# Altium schematic sheet 407.SchDoc
size A1
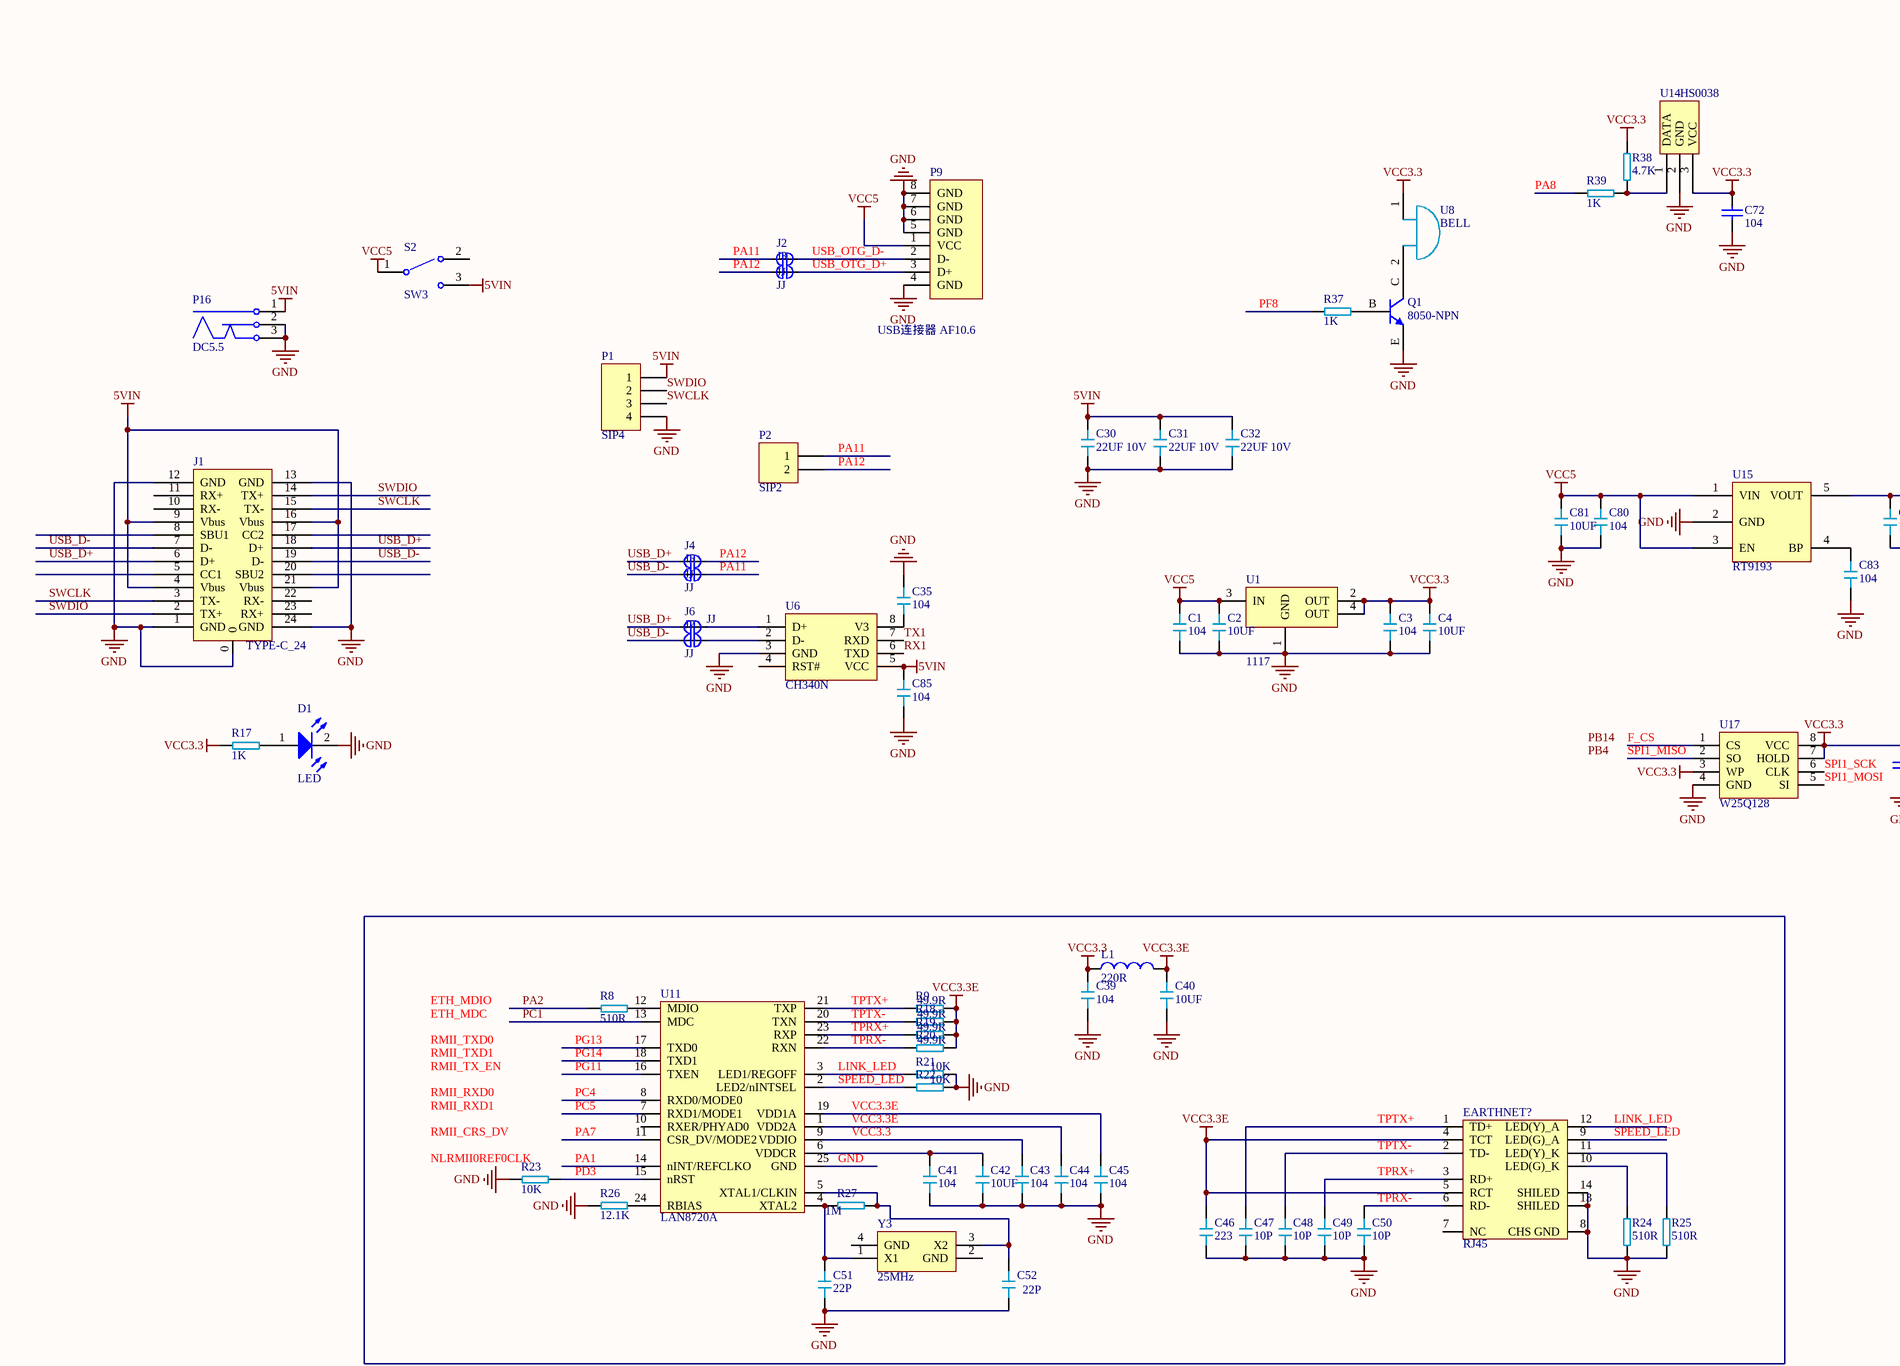
[diagram p0: 407.SchDoc, top left]
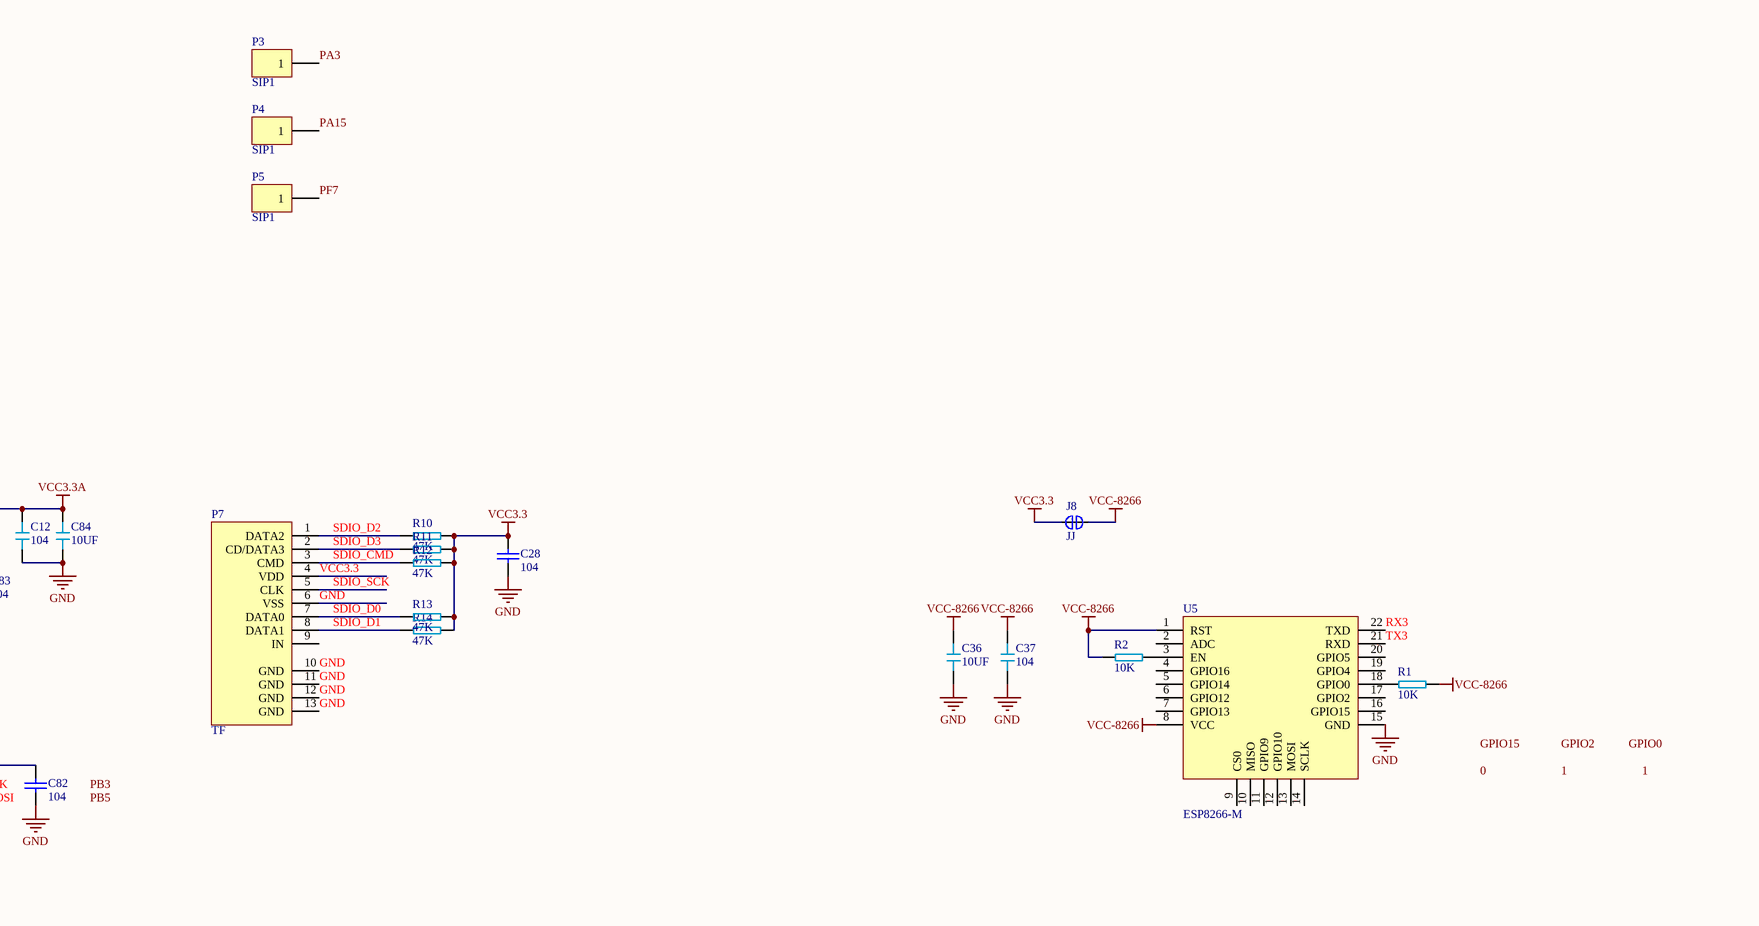
[diagram p1: 407.SchDoc, top right]
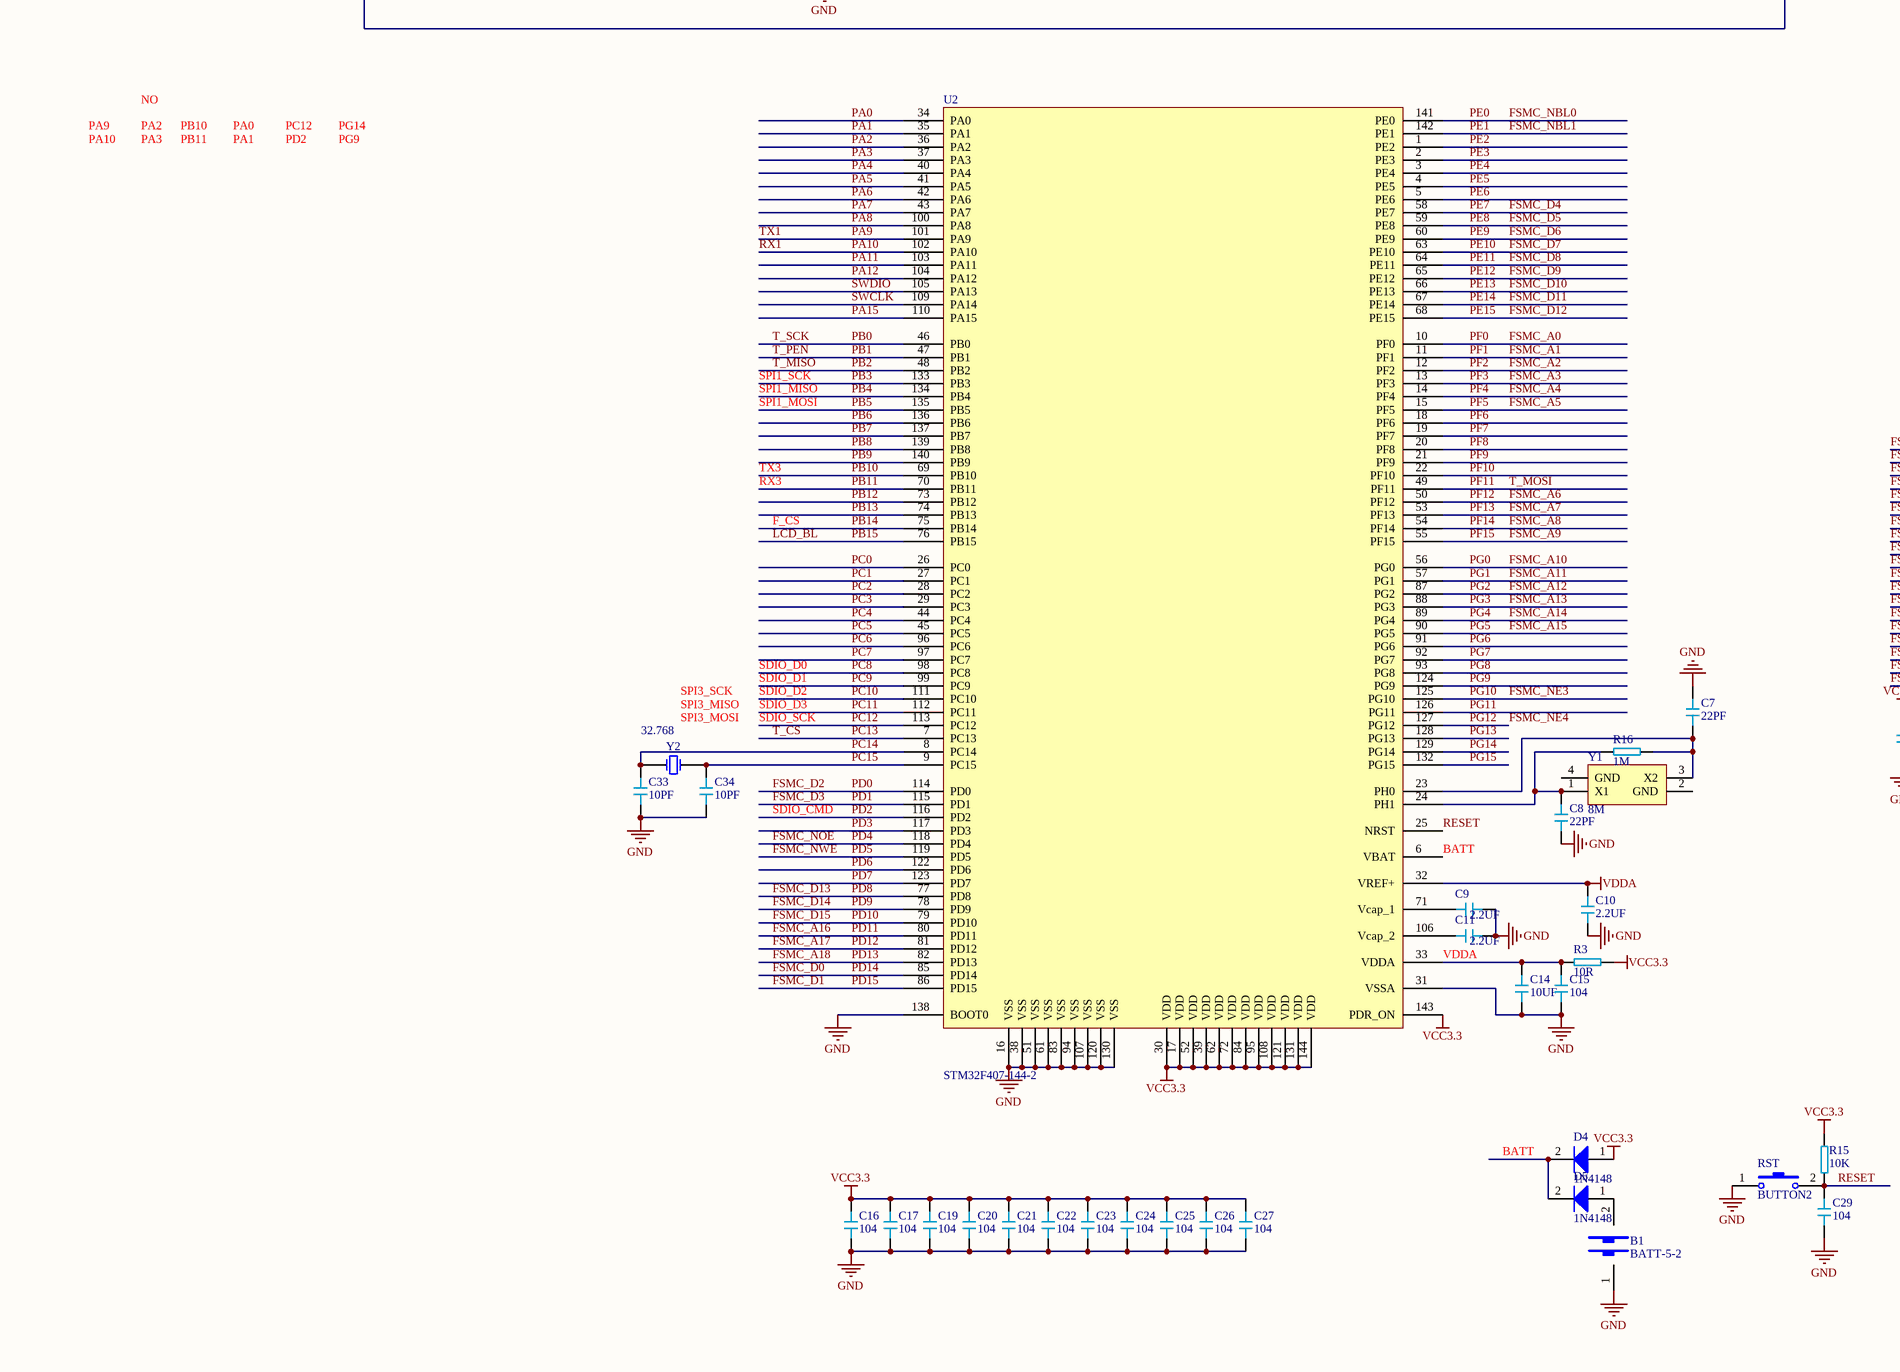
[diagram p2: 407.SchDoc, bottom left]
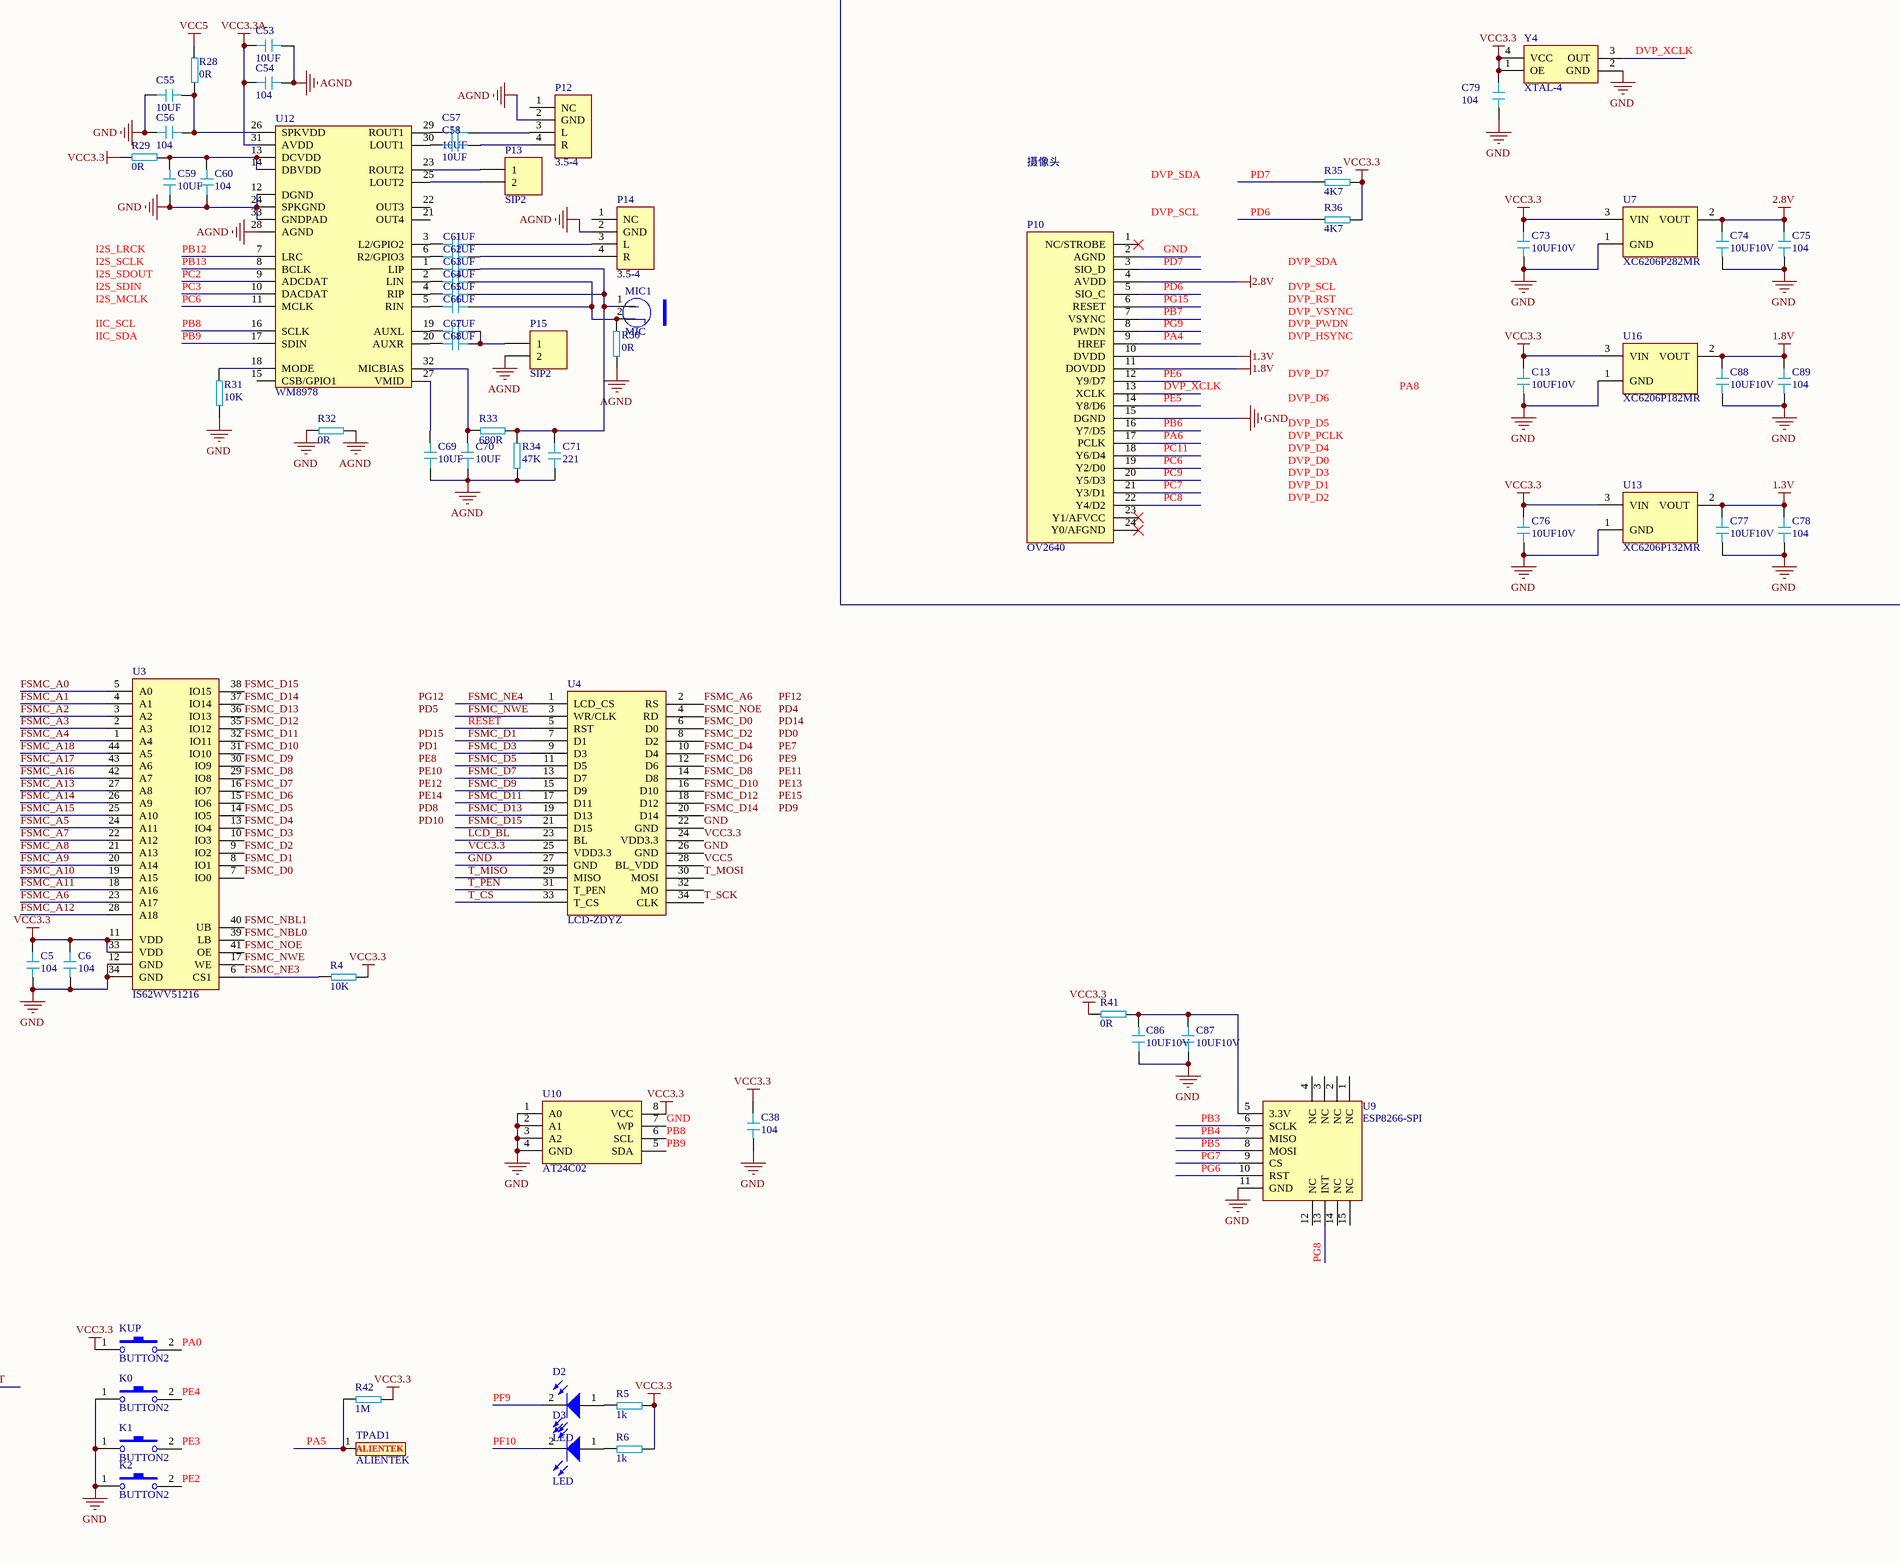
[diagram p3: 407.SchDoc, bottom right]

## Parts
B1  BATT-5-2  [BATT1210]
C1  104  [C0402]
C2  10UF  [C0603]
C3  104  [C0402]
C4  10UF  [C0603]
C5  104  [C0402]
C6  104  [C0402]
C7  22PF  [C0402]
C8  22PF  [C0402]
C9  2.2UF  [C0402]
C10  2.2UF  [C0402]
C11  2.2UF  [C0402]
C12  104  [C0402]
C13  10UF10V  [C0603]
C14  10UF  [C0402]
C15  104  [C0402]
C16  104  [C0402]
C17  104  [C0402]
C19  104  [C0402]
C20  104  [C0402]
C21  104  [C0402]
C22  104  [C0402]
C23  104  [C0402]
C24  104  [C0402]
C25  104  [C0402]
C26  104  [C0402]
C27  104  [C0402]
C28  104  [C0402]
C29  104  [C0402]
C30  22UF 10V  [C0805]
C31  22UF 10V  [C0805]
C32  22UF 10V  [C0805]
C33  10PF  [C0402]
C34  10PF  [C0402]
C35  104  [C0402]
C36  10UF  [C0603]
C37  104  [C0402]
C38  104  [C0402]
C39  104  [C0402]
C40  10UF  [C0603]
C41  104  [C0402]
C42  10UF  [C0603]
C43  104  [C0402]
C44  104  [C0402]
C45  104  [C0402]
C46  223  [C0402]
C47  10P  [C0402]
C48  10P  [C0402]
C49  10P  [C0402]
C50  10P  [C0402]
C51  22P  [C0402]
C52  22P  [C0402]
C53  10UF  [C0603]
C54  104  [C0402]
C55  10UF  [C0603]
C56  104  [C0402]
C57  10UF  [C0603]
C58  10UF  [C0603]
C59  10UF  [C0603]
C60  104  [C0402]
C61  1UF  [C0402]
C62  1UF  [C0402]
C63  1UF  [C0402]
C64  1UF  [C0402]
C65  1UF  [C0402]
C66  1UF  [C0402]
C67  1UF  [C0402]
C68  1UF  [C0402]
C69  10UF  [C0603]
C70  10UF  [C0603]
C71  221  [C0402]
C72  104  [C0402]
C73  10UF10V  [C0603]
C74  10UF10V  [C0603]
C75  104  [C0402]
C76  10UF10V  [C0603]
C77  10UF10V  [C0603]
C78  104  [C0402]
C79  104  [C0402]
C80  104  [C0402]
C81  10UF  [C0603]
C82  104  [C0402]
C83  104  [C0402]
C84  10UF  [C0603]
C85  104  [C0402]
C86  10UF10V  [C0603]
C87  10UF10V  [C0603]
C88  10UF10V  [C0603]
C89  104  [C0402]
D1  LED  [LED0603]
D2  LED  [LED0603]
D3  LED  [LED0603]
D4  1N4148  [SOD123]
D5  1N4148  [SOD123]
EARTHNET?  RJ45  [HR911105A]
J1  TYPE-C_24  [TYPE-C24P]
J2  JJ  [JJ]
J3  JJ  [JJ]
J4  JJ  [JJ]
J5  JJ  [JJ]
J6  JJ  [JJ]
J7  JJ  [JJ]
J8  JJ  [JJ]
K0  BUTTON2  [BUTTON-SMD-6*6-4]
K1  BUTTON2  [BUTTON-SMD-6*6-4]
K2  BUTTON2  [BUTTON-SMD-6*6-4]
KUP  BUTTON2  [BUTTON-SMD-6*6-4]
L1  220R  [R0603]
MIC1  MIC  [MIC-6022]
P1  SIP4  [SIP4-DIP-90]
P2  SIP2  [SIP2]
P3  SIP1  [TEST-SMD-1.5MM]
P4  SIP1  [TEST-SMD-1.5MM]
P5  SIP1  [TEST-SMD-1.5MM]
P7  TF  [TF-CARD]
P9  USB连接器 AF10.6  [USB-AF10.6]
P10  OV2640  [OV2640]
P12  3.5-4  [ERJI-3.5-4]
P13  SIP2  [SIP2]
P14  3.5-4  [ERJI-3.5-4]
P15  SIP2  [SIP2]
P16  DC5.5  [DC-5.5]
Q1  8050-NPN  [SOT-23]
R1  10K  [R0402]
R2  10K  [R0402]
R3  10R  [R0402]
R4  10K  [R0402]
R5  1k  [R0402]
R6  1k  [R0402]
R8  510R  [R0402]
R9  49.9R  [R0402]
R10  47K  [R0402]
R11  47K  [R0402]
R12  47K  [R0402]
R13  47K  [R0402]
R14  47K  [R0402]
R15  10K  [R0402]
R16  1M  [R0402]
R17  1K  [R0402]
R18  49.9R  [R0402]
R19  49.9R  [R0402]
R20  49.9R  [R0402]
R21  10K  [R0402]
R22  10K  [R0402]
R23  10K  [R0402]
R24  510R  [R0402]
R25  510R  [R0402]
R26  12.1K  [R0402]
R27  1M  [R0402]
R28  0R  [R0402]
R29  0R  [R0402]
R30  0R  [R0402]
R31  10K  [R0402]
R32  0R  [R0402]
R33  680R  [R0402]
R34  47K  [R0402]
R35  4K7  [R0603]
R36  4K7  [R0603]
R37  1K  [R0402]
R38  4.7K  [R0402]
R39  1K  [R0402]
R41  0R  [R0402]
R42  1M  [R0603]
RST  BUTTON2  [BUTTON-SMD-6*6-4]
S2  SW3  [SW3-90-SMD]
TPAD1  ALIENTEK  [ATK_TPAD]
U1  1117  [SOT223]
U2  STM32F407-144-2  [LQFP144]
U3  IS62WV51216  [TSOP44]
U4  LCD-ZDYZ  [LCD-ZDYZ]
U5  ESP8266-M  [ESP8266]
U6  CH340N  [SO8]
U7  XC6206P282MR  [SOT-23-123]
U8  BELL  [BELL-MLT-9650]
U9  ESP8266-SPI  [ESP8266-SPI]
U10  AT24C02  [SO8]
U11  LAN8720A  [QFN24]
U12  WM8978  [qfn32]
U13  XC6206P132MR  [SOT-23-123]
U14  HS0038  [HS0038]
U15  RT9193  [SOT-25]
U16  XC6206P182MR  [SOT-23-123]
U17  W25Q128  [SO8 -8.0]
Y1  8M  [XTAL-3225-4]
Y2  32.768  [XTAL-32768-2*6]
Y3  25MHz  [XTAL-3225-4]
Y4  XTAL-4  [XTAL-3225-4]

## Nets
1.3V: C77.2 C78.2 P10.10(DVDD) U13.2(VOUT)
1.8V: C88.2 C89.2 P10.11(DOVDD) U16.2(VOUT)
2.8V: C74.2 C75.2 P10.4(AVDD) U7.2(VOUT)
5VIN: C30.2 C31.2 C32.2 C85.2 J1.4(Vbus) J1.9(Vbus) J1.16(Vbus) J1.21(Vbus) P1.1 P16.1(T) S2.3 U6.5(VCC)
AGND: C53.1 C54.1 C69.2 C70.2 C71.1 P12.2(GND) P14.2(GND) P15.2 R30.1 R32.2 R34.1 U12.28(AGND)
GND: B1.1 C1.1 C2.1 C3.1 C4.1 C5.1 C6.1 C7.2 C8.1 C9.1 C10.2 C11.1 C12.1 C13.1 C14.2 C15.2 C16.1 C17.1 C19.1 C20.1 C21.1 C22.1 C23.1 C24.1 C25.1 C26.1 C27.1 C28.2 C29.2 C30.1 C31.1 C32.1 C33.1 C34.1 C35.2 C36.1 C37.1 C38.1 C39.1 C40.1 C41.1 C42.1 C43.1 C44.1 C45.1 C46.1 C47.1 C48.1 C49.1 C50.1 C51.1 C52.1 C55.2 C56.2 C59.2 C60.2 C72.2 C73.1 C74.1 C75.1 C76.1 C77.1 C78.1 C79.1 C80.1 C81.1 C82.2 C83.1 C84.1 C85.1 C86.2 C87.2 C88.1 C89.1 D1.2(K) EARTHNET?.8(CHS_GND) EARTHNET?.13(SHILED) EARTHNET?.14(SHILED) J1.0 J1.1(GND) J1.12(GND) J1.13(GND) J1.24(GND) K0.1 K1.1 K2.1 P1.4 P7.6(VSS) P7.10(GND) P7.11(GND) P7.12(GND) P7.13(GND) P9.4(GND) P9.5(GND) P9.6(GND) P9.7(GND) P9.8(GND) P10.2(AGND) P10.15(DGND) P16.2(TN) P16.3 Q1.E R21.2 R22.2 R23.1 R24.2 R25.2 R26.1 R31.2 R32.1 RST.1 U1.1(GND) U2.16(VSS) U2.31(VSSA) U2.38(VSS) U2.51(VSS) U2.61(VSS) U2.83(VSS) U2.94(VSS) U2.107(VSS) U2.120(VSS) U2.130(VSS) U2.138(BOOT0) U3.12(GND) U3.34(GND) U4.22(GND) U4.26(GND) U4.27(GND) U5.15(GND) U6.3(GND) U7.1(GND) U9.11(GND) U10.1(A0) U10.2(A1) U10.3(A2) U10.4(GND) U10.7(WP) U11.25(GND) U12.12(DGND) U12.24(SPKGND) U12.33(GNDPAD) U13.1(GND) U14.2(GND) U15.2(GND) U16.1(GND) U17.4(GND) Y4.2(GND)
VCC3.3: C3.2 C4.2 C5.2 C6.2 C13.2 C16.2 C17.2 C19.2 C20.2 C21.2 C22.2 C23.2 C24.2 C25.2 C26.2 C27.2 C28.1 C38.2 C39.2 C43.2 C72.1 C73.2 C76.2 C79.2 C82.1 D4.1(A) J8.1 KUP.1 L1.1 P7.4(VDD) R3.1 R4.2 R5.2 R6.2 R10.2 R11.2 R12.2 R13.2 R14.2 R15.2 R17.1 R29.2 R35.2 R36.2 R38.2 R41.2 R42.2 U1.2(OUT) U1.4(OUT) U2.17(VDD) U2.30(VDD) U2.39(VDD) U2.52(VDD) U2.62(VDD) U2.72(VDD) U2.84(VDD) U2.95(VDD) U2.108(VDD) U2.121(VDD) U2.131(VDD) U2.143(PDR_ON) U2.144(VDD) U3.11(VDD) U3.33(VDD) U4.24(VDD3.3) U4.25(VDD3.3) U7.3(VIN) U8.1 U10.8(VCC) U11.9(VDDIO) U13.3(VIN) U14.3(VCC) U16.3(VIN) U17.3(WP) U17.7(HOLD) U17.8(VCC) Y4.1(OE) Y4.4(VCC)
VCC3.3A: C12.2 C53.2 C54.2 C84.2 U12.31(AVDD) U15.5(VOUT)
VCC3.3E: C40.2 C44.2 C45.2 C46.2 EARTHNET?.4(TCT) EARTHNET?.5(RCT) L1.2 R9.2 R18.2 R19.2 R20.2 U11.1(VDD2A) U11.19(VDD1A)
VCC5: C1.2 C2.2 C80.2 C81.2 P9.1(VCC) R28.1 S2.1 U1.3(IN) U4.28(BL_VDD) U15.1(VIN) U15.3(EN)
VCC-8266: C36.2 C37.2 J8.2 R1.1 R2.2 U5.1(RST) U5.8(VCC)
VDDA: C10.1 C14.1 C15.1 R3.2 U2.32(VREF+) U2.33(VDDA)
BATT: D4.2(K) D5.2(K) U2.6(VBAT)
DVP_XCLK: P10.13(XCLK) Y4.3(OUT)
F_CS: U2.75(PB14) U17.1(CS)  [also labelled PB14]
FSMC_A0: U2.10(PF0) U3.5(A0)  [also labelled PF0]
FSMC_A1: U2.11(PF1) U3.4(A1)  [also labelled PF1]
FSMC_A2: U2.12(PF2) U3.3(A2)  [also labelled PF2]
FSMC_A3: U2.13(PF3) U3.2(A3)  [also labelled PF3]
FSMC_A4: U2.14(PF4) U3.1(A4)  [also labelled PF4]
FSMC_A5: U2.15(PF5) U3.24(A11)  [also labelled PF5]
FSMC_A6: U2.50(PF12) U3.23(A17) U4.2(RS)  [also labelled PF12]
FSMC_A7: U2.53(PF13) U3.22(A12)  [also labelled PF13]
FSMC_A8: U2.54(PF14) U3.21(A13)  [also labelled PF14]
FSMC_A9: U2.55(PF15) U3.20(A14)  [also labelled PF15]
FSMC_A10: U2.56(PG0) U3.19(A15)  [also labelled PG0]
FSMC_A11: U2.57(PG1) U3.18(A16)  [also labelled PG1]
FSMC_A12: U2.87(PG2) U3.28(A18)  [also labelled PG2]
FSMC_A13: U2.88(PG3) U3.27(A8)  [also labelled PG3]
FSMC_A14: U2.89(PG4) U3.26(A9)  [also labelled PG4]
FSMC_A15: U2.90(PG5) U3.25(A10)  [also labelled PG5]
FSMC_A16: U2.80(PD11) U3.42(A7)  [also labelled PD11]
FSMC_A17: U2.81(PD12) U3.43(A6)  [also labelled PD12]
FSMC_A18: U2.82(PD13) U3.44(A5)  [also labelled PD13]
FSMC_D0: U2.85(PD14) U3.7(IO0) U4.6(D0)  [also labelled PD14]
FSMC_D1: U2.86(PD15) U3.8(IO1) U4.7(D1)  [also labelled PD15]
FSMC_D2: U2.114(PD0) U3.9(IO2) U4.8(D2)  [also labelled PD0]
FSMC_D3: U2.115(PD1) U3.10(IO3) U4.9(D3)  [also labelled PD1]
FSMC_D4: U2.58(PE7) U3.13(IO4) U4.10(D4)  [also labelled PE7]
FSMC_D5: U2.59(PE8) U3.14(IO5) U4.11(D5)  [also labelled PE8]
FSMC_D6: U2.60(PE9) U3.15(IO6) U4.12(D6)  [also labelled PE9]
FSMC_D7: U2.63(PE10) U3.16(IO7) U4.13(D7)  [also labelled PE10]
FSMC_D8: U2.64(PE11) U3.29(IO8) U4.14(D8)  [also labelled PE11]
FSMC_D9: U2.65(PE12) U3.30(IO9) U4.15(D9)  [also labelled PE12]
FSMC_D10: U2.66(PE13) U3.31(IO10) U4.16(D10)  [also labelled PE13]
FSMC_D11: U2.67(PE14) U3.32(IO11) U4.17(D11)  [also labelled PE14]
FSMC_D12: U2.68(PE15) U3.35(IO12) U4.18(D12)  [also labelled PE15]
FSMC_D13: U2.77(PD8) U3.36(IO13) U4.19(D13)  [also labelled PD8]
FSMC_D14: U2.78(PD9) U3.37(IO14) U4.20(D14)  [also labelled PD9]
FSMC_D15: U2.79(PD10) U3.38(IO15) U4.21(D15)  [also labelled PD10]
FSMC_NBL0: U2.141(PE0) U3.39(LB)  [also labelled PE0]
FSMC_NBL1: U2.142(PE1) U3.40(UB)  [also labelled PE1]
FSMC_NE3: R4.1 U2.125(PG10) U3.6(CS1)  [also labelled PG10]
FSMC_NE4: U2.127(PG12) U4.1(LCD_CS)  [also labelled PG12]
FSMC_NOE: U2.118(PD4) U3.41(OE) U4.4(RD)  [also labelled PD4]
FSMC_NWE: U2.119(PD5) U3.17(WE) U4.3(WR/CLK)  [also labelled PD5]
LCD_BL: U2.76(PB15) U4.23(BL)  [also labelled PB15]
LINK_LED: EARTHNET?.12(LED(Y)_A) R21.1 U11.3(LED1/REGOFF)
PA0: KUP.2 U2.34(PA0)
PA1: U2.35(PA1) U11.14(nINT/REFCLKO)
PA2: R8.1 U2.36(PA2)
PA3: P3.1 U2.37(PA3)
PA4: P10.9(HREF) U2.40(PA4)
PA5: R42.1 TPAD1.1 U2.41(PA5)
PA6: P10.17(PCLK) U2.42(PA6)
PA7: U2.43(PA7) U11.11(CSR_DV/MODE2)
PA8: R39.1 U2.100(PA8)
PA9: U2.101(PA9) U6.7(RXD)  [also labelled TX1]
PA10: U2.102(PA10) U6.6(TXD)  [also labelled RX1]
PA11: J2.1 J5.2 P2.1 U2.103(PA11)
PA12: J3.1 J4.2 P2.2 U2.104(PA12)
PA15: P4.1 U2.110(PA15)
PB0: U2.46(PB0) U4.34(CLK)  [also labelled T_SCK]
PB1: U2.47(PB1) U4.31(T_PEN)  [also labelled T_PEN]
PB2: U2.48(PB2) U4.29(MISO)  [also labelled T_MISO]
PB3: U2.133(PB3) U9.6(SCLK) U17.6(CLK)  [also labelled SPI1_SCK]
PB4: U2.134(PB4) U9.7(MISO) U17.2(SO)  [also labelled SPI1_MISO]
PB5: U2.135(PB5) U9.8(MOSI) U17.5(SI)  [also labelled SPI1_MOSI]
PB6: P10.16(Y7/D5) U2.136(PB6)
PB7: P10.7(VSYNC) U2.137(PB7)
PB8: U2.139(PB8) U10.6(SCL) U12.16(SCLK)
PB9: U2.140(PB9) U10.5(SDA) U12.17(SDIN)
PB10: U2.69(PB10) U5.21(RXD)  [also labelled TX3]
PB11: U2.70(PB11) U5.22(TXD)  [also labelled RX3]
PB12: U2.73(PB12) U12.7(LRC)
PB13: U2.74(PB13) U12.8(BCLK)
PC0: U2.26(PC0)
PC1: U2.27(PC1) U11.13(MDC)
PC2: U2.28(PC2) U12.9(ADCDAT)
PC3: U2.29(PC3) U12.10(DACDAT)
PC4: U2.44(PC4) U11.8(RXD0/MODE0)
PC5: U2.45(PC5) U11.7(RXD1/MODE1)
PC6: P10.19(Y2/D0) U2.96(PC6) U12.11(MCLK)
PC7: P10.21(Y3/D1) U2.97(PC7)
PC8: P7.7(DATA0) P10.22(Y4/D2) R13.1 U2.98(PC8)  [also labelled SDIO_D0]
PC9: P7.8(DATA1) P10.20(Y5/D3) R14.1 U2.99(PC9)  [also labelled SDIO_D1]
PC10: P7.1(DATA2) R10.1 U2.111(PC10)  [also labelled SDIO_D2]
PC11: P7.2(CD/DATA3) P10.18(Y6/D4) R11.1 U2.112(PC11)  [also labelled SDIO_D3]
PC12: P7.5(CLK) U2.113(PC12)  [also labelled SDIO_SCK]
PC13: U2.7(PC13) U4.33(T_CS)  [also labelled T_CS]
PC14: C33.2 U2.8(PC14) Y2.1(OSC1)
PC15: C34.2 U2.9(PC15) Y2.2(OSC2)
PD2: P7.3(CMD) R12.1 U2.116(PD2)  [also labelled SDIO_CMD]
PD3: R23.2 U2.117(PD3) U11.15(nRST)
PD6: P10.5(SIO_C) R36.1 U2.122(PD6)
PD7: P10.3(SIO_D) R35.1 U2.123(PD7)
PE2: K2.2 U2.1(PE2)
PE3: K1.2 U2.2(PE3)
PE4: K0.2 U2.3(PE4)
PE5: P10.14(Y8/D6) U2.4(PE5)
PE6: P10.12(Y9/D7) U2.5(PE6)
PF6: U2.18(PF6)
PF7: P5.1 U2.19(PF7)
PF8: R37.1 U2.20(PF8)
PF9: D2.2(K) U2.21(PF9)
PF10: D3.2(K) U2.22(PF10)
PF11: U2.49(PF11) U4.30(MOSI)  [also labelled T_MOSI]
PG6: U2.91(PG6) U9.10(RST)
PG7: U2.92(PG7) U9.9(CS)
PG8: U2.93(PG8) U9.13(INT)
PG9: P10.8(PWDN) U2.124(PG9)
PG11: U2.126(PG11) U11.16(TXEN)
PG13: U2.128(PG13) U11.17(TXD0)
PG14: U2.129(PG14) U11.18(TXD1)
PG15: P10.6(RESET) U2.132(PG15)
RESET: C29.1 R15.1 RST.2 U2.25(NRST) U4.5(RST)
SPEED_LED: EARTHNET?.9(LED(G)_A) R22.1 U11.2(LED2/nINTSEL)
SWCLK: J1.3(TX-) J1.15(TX-) P1.3 U2.109(PA14)
SWDIO: J1.2(TX+) J1.14(TX+) P1.2 U2.105(PA13)
TPRX+: C49.2 EARTHNET?.3(RD+) R19.1 U11.23(RXP)
TPRX-: C50.2 EARTHNET?.6(RD-) R20.1 U11.22(RXN)
TPTX+: C47.2 EARTHNET?.1(TD+) R9.1 U11.21(TXP)
TPTX-: C48.2 EARTHNET?.2(TD-) R18.1 U11.20(TXN)
USB_D+: J1.6(D+) J1.18(D+) J4.1 J6.1
USB_D-: J1.7(D-) J1.19(D-) J5.1 J7.1
USB_OTG_D+: J3.2 P9.3(D+)
USB_OTG_D-: J2.2 P9.2(D-)
NetB1_2: B1.2 D5.1(A)
NetC7_1: C7.1 R16.1 U2.23(PH0) Y1.3(X2)
NetC8_2: C8.2 R16.2 U2.24(PH1) Y1.1(X1)
NetC9_2: C9.2 U2.71(Vcap_1)
NetC11_2: C11.2 U2.106(Vcap_2)
NetC35_1: C35.1 U6.8(V3)
NetC41_2: C41.2 C42.2 U11.6(VDDCR)
NetC51_2: C51.2 R27.1 U11.4(XTAL2) Y3.1(X1)
NetC52_2: C52.2 R27.2 U11.5(XTAL1/CLKIN) Y3.3(X2)
NetC55_1: C55.1 C56.1 R28.2 U12.26(SPKVDD)
NetC57_1: C57.1 P12.3(L)
NetC57_2: C57.2 U12.29(ROUT1)
NetC58_1: C58.1 P12.4(R)
NetC58_2: C58.2 U12.30(LOUT1)
NetC59_1: C59.1 C60.1 R29.1 U12.13(DCVDD) U12.14(DBVDD)
NetC61_1: C61.1 U12.3(L2/GPIO2)
NetC61_2: C61.2 P14.3(L)
NetC62_1: C62.1 U12.6(R2/GPIO3)
NetC62_2: C62.2 P14.4(R)
NetC63_1: C63.1 U12.1(LIP)
NetC63_2: C63.2 C65.2 C71.2 MIC1.1(VCC) R33.2 R34.2
NetC64_1: C64.1 U12.2(LIN)
NetC64_2: C64.2 C66.2 MIC1.2(GND) R30.2
NetC65_1: C65.1 U12.4(RIP)
NetC66_1: C66.1 U12.5(RIN)
NetC67_1: C67.1 U12.19(AUXL)
NetC67_2: C67.2 C68.2 P15.1
NetC68_1: C68.1 U12.20(AUXR)
NetC69_1: C69.1 U12.27(VMID)
NetC70_1: C70.1 R33.1 U12.32(MICBIAS)
NetC83_2: C83.2 U15.4(BP)
NetC86_1: C86.1 C87.1 R41.1 U9.5(3.3V)
NetD1_1: D1.1(A) R17.2
NetD2_1: D2.1(A) R5.1
NetD3_1: D3.1(A) R6.1
NetEARTHNET?_10: EARTHNET?.10(LED(G)_K) R24.1
NetEARTHNET?_11: EARTHNET?.11(LED(Y)_K) R25.1
NetJ6_2: J6.2 U6.1(D+)
NetJ7_2: J7.2 U6.2(D-)
NetP13_1: P13.1 U12.23(ROUT2)
NetP13_2: P13.2 U12.25(LOUT2)
NetQ1_B: Q1.B R37.2
NetQ1_C: Q1.C U8.2
NetR1_2: R1.2 U5.18(GPIO0)
NetR2_1: R2.1 U5.3(EN)
NetR8_2: R8.2 U11.12(MDIO)
NetR26_2: R26.2 U11.24(RBIAS)
NetR31_1: R31.1 U12.18(MODE)
NetR38_1: R38.1 R39.2 U14.1(DATA)

Not connected (* = marked no-connect by the designer): EARTHNET? 7(NC); J1 5(CC1) 8(SBU1) 10(RX-) 11(RX+) 17(CC2) 20(SBU2) 22(RX-) 23(RX+); P7 9(IN); P10 1(NC/STROBE)* 23(Y1/AFVCC)* 24(Y0/AFGND)*; P12 1(NC); P14 1(NC); S2 2; U4 32(MO); U5 2(ADC) 4(GPIO16) 5(GPIO14) 6(GPIO12) 7(GPIO13) 9(CS0) 10(MISO) 11(GPIO9) 12(GPIO10) 13(MOSI) 14(SCLK) 16(GPIO15) 17(GPIO2) 19(GPIO4) 20(GPIO5); U6 4(RST#); U9 1(NC) 2(NC) 3(NC) 4(NC) 12(NC) 14(NC) 15(NC); U11 10(RXER/PHYAD0); U12 15(CSB/GPIO1) 21(OUT4) 22(OUT3); Y1 2(GND) 4(GND); Y3 2(GND) 4(GND)

## Notes on the sheet
- 摄像头
- Labels drawn without touching a wire or pin: 0, 1, DVP_D0, DVP_D1, DVP_D2, DVP_D3, DVP_D4, DVP_D5, DVP_D6, DVP_D7, DVP_HSYNC, DVP_PCLK, DVP_PWDN, DVP_RST, DVP_SCL, DVP_SDA, DVP_VSYNC, ETH_MDC, ETH_MDIO, GPIO0, GPIO2, GPIO15, I2S_LRCK, I2S_MCLK, I2S_SCLK, I2S_SDIN, I2S_SDOUT, IIC_SCL, IIC_SDA, NLRMII0REF0CLK, NO, PA0, PA1, PA2, PA3, PA8, PA9, PA10, PB3, PB4, PB5, PB10, PB11, PB14, PC12, PD0, PD1, PD2, PD4, PD5, PD8, PD9, PD10, PD14, PD15, PE7, PE8, PE9, PE10, PE11, PE12, PE13, PE14, PE15, PF12, PG9, PG12, PG14, RMII_CRS_DV, RMII_RXD0, RMII_RXD1, RMII_TX_EN, RMII_TXD0, RMII_TXD1, SPI3_MISO, SPI3_MOSI, SPI3_SCK

## Library data of the parts
B1 = BATT-5-2: BUTTON4; Published: 24-Mar-1999; LatestRevisionDate: 17-Jul-2002; LatestRevisionNote: Re-released for DXP Platform.; PackageReference: SPST-2; Publisher: Altium Limited; PackageDescription: Switch; 2 Leads
C1-C12 C14-C17 C19-C27 C29 C33 C34 C36-C38 C80 C81 C83 C84 = C0603: 100NF
C13 C35 C39-C71 C73-C79 C85-C89 = C0603: 贴片电容
C28 C72 C82 = Cap: Capacitor; Published: 8-Jun-2000; LatestRevisionDate: 17-Jul-2002; LatestRevisionNote: Re-released for DXP Platform.; PackageReference: RAD-0.3; Publisher: Altium Limited; PackageDescription: Radial Cap, Thru-Hole; 2 Leads; 0.3 in Pin Spacing
C30-C32 = C0805: 100NF
D1-D3 = LED0603: Typical INFRARED GaAs LED; Published: 8-Jun-2000; LatestRevisionDate: 08-Jul-2005; LatestRevisionNote: Mech Layer 1 removed.; PackageReference: LED-0; Publisher: Altium Limited; PackageDescription: LED; 2 Leads
D4 D5 = DD: High Conductance Fast Diode; Published: 8-Jun-2000; LatestRevisionDate: 17-Jul-2002; LatestRevisionNote: Re-released for DXP Platform.; DatasheetVersion: 1997; PackageReference: DO-35; Publisher: Altium Limited; PackageDescription: Diode, Axial; Body 3.8 x 1.9 mm (LxDia. max), Lead Dia. 0.53 mm (max); Code_JEDEC: DO-204-AH; ComponentLink1Description: Manufacturer Link; ComponentLink1URL: http://www.fairchildsemi.com/; ComponentLink2Description: Datasheet; ComponentLink2URL: http://www.fairchildsemi.com/ds/1N%2F1N4448.pdf
EARTHNET? = HR911105
J2-J8 = JJ: 跳线
L1 = Inductor: 电感; Code_IEC: 1005; Published: 8-Jun-2000; LatestRevisionDate: 29-May-2009; LatestRevisionNote: IPC-7351 Footprint Added.; PackageReference: 0402-A; Publisher: Altium Limited; PackageDescription: Chip Inductor; Code_JEITA: 0402
P1 = SIP4: 连接器; LatestRevisionDate: 17-Jul-2002; LatestRevisionNote: Re-released for DXP Platform.; Publisher: Altium Limited
P2 P13 P15 = SIP2: 连接器; LatestRevisionDate: 17-Jul-2002; LatestRevisionNote: Re-released for DXP Platform.; Publisher: Altium Limited
P3-P5 = SIP1: 连接器; LatestRevisionDate: 17-Jul-2002; LatestRevisionNote: Re-released for DXP Platform.; Publisher: Altium Limited
P9 = USB-A-90
P12 P14 = 3.5-4_1: 连接器; Published: 5-Jan-2004; LatestRevisionDate: 17-Dec-2003; LatestRevisionNote: PCB Footprint replaced.; DatasheetDocument: 07-Mar-2000; Publisher: Altium Limited; ComponentLink1Description: Manufacturer Link; ComponentLink1URL: http://domino.kycon.com/internet/Products.html
P16 = DC5.5: 连接器; PackageDocument: 2003; PCB_Layout: Complies with manufacturer's recommendation.; DrillAndSlotSize: Corresponds to nominal value.; LatestRevisionDate: 15-Jul-2004; LatestRevisionNote: Component Replaced & renamed from "Phonejack".; DatasheetDocument: 2003; PackageReference: S1VS_SNB; Publisher: Altium Limited; ComponentLink1Description: Manufacturer Link; ComponentLink1URL: http://www.cliffuk.co.uk/
Q1 = 8050: 三极管; Published: 8-Jun-2000; LatestRevisionDate: 17-Jul-2002; LatestRevisionNote: Re-released for DXP Platform.; PackageReference: TO-226-AA; Publisher: Altium Limited; PackageDescription: TO, Flat Index; 3 In-Line, Axial Leads; Body Dia. 4.8mm; Leads 0.55 x 0.51 mm (max); Code_JEDEC: TO-226-AA
R1-R6 R10-R17 = R-0603
R8 R9 R18-R34 R37-R39 R41 = R-0402: 贴片电阻
R35 R36 R42 = R-0603: 贴片电阻
U1 = 1117: Header, 2-Pin; LatestRevisionDate: 17-Jul-2002; LatestRevisionNote: Re-released for DXP Platform.; Publisher: Altium Limited
U6 = CH340N: 芯片
U7 U13 U16 = XC6206P282MR: 芯片
U8 = BELL: 蜂鸣器
U9 = ESP8266-SPI: 芯片
U11 = LAN8720: ETH PHY
U12 = WM8978: 24bit ADC&DAC
Y1 Y3 = XTAL-4-W: Crystal Oscillator; Published: 8-Jun-2000; LatestRevisionDate: 17-Jul-2002; LatestRevisionNote: Re-released for DXP Platform.; PackageReference: R38; Publisher: Altium Limited; PackageDescription: Crystal, Thru-Hole; 2 Leads; Body 3.1 x 8.2 mm (Dia.xH)
Y2 = XTAL-5032: Crystal Oscillator; Published: 8-Jun-2000; LatestRevisionDate: 17-Jul-2002; LatestRevisionNote: Re-released for DXP Platform.; PackageReference: R38; Publisher: Altium Limited; PackageDescription: Crystal, Thru-Hole; 2 Leads; Body 3.1 x 8.2 mm (Dia.xH)
Y4 = XTAL-4: 有源晶振; Published: 8-Jun-2000; LatestRevisionDate: 17-Jul-2002; LatestRevisionNote: Re-released for DXP Platform.; PackageReference: R38; Publisher: Altium Limited; PackageDescription: Crystal, Thru-Hole; 2 Leads; Body 3.1 x 8.2 mm (Dia.xH)
K0-K2 KUP RST = BUTTON2: Published: 24-Mar-1999; LatestRevisionDate: 17-Jul-2002; LatestRevisionNote: Re-released for DXP Platform.; PackageReference: SPST-2; Publisher: Altium Limited; PackageDescription: Switch; 2 Leads
S2 = SW3: Published: 24-Mar-1999; LatestRevisionDate: 17-Jul-2002; LatestRevisionNote: Re-released for DXP Platform.; PackageReference: SPST-2; Publisher: Altium Limited; PackageDescription: Switch; 2 Leads